# Altium schematic sheet 12_ADAU7118_CODEC.SchDoc: ADAU7118 PDM to TDM Codec
size B; DocumentNumber: 8; SheetNumber: 8; SheetTotal: 12
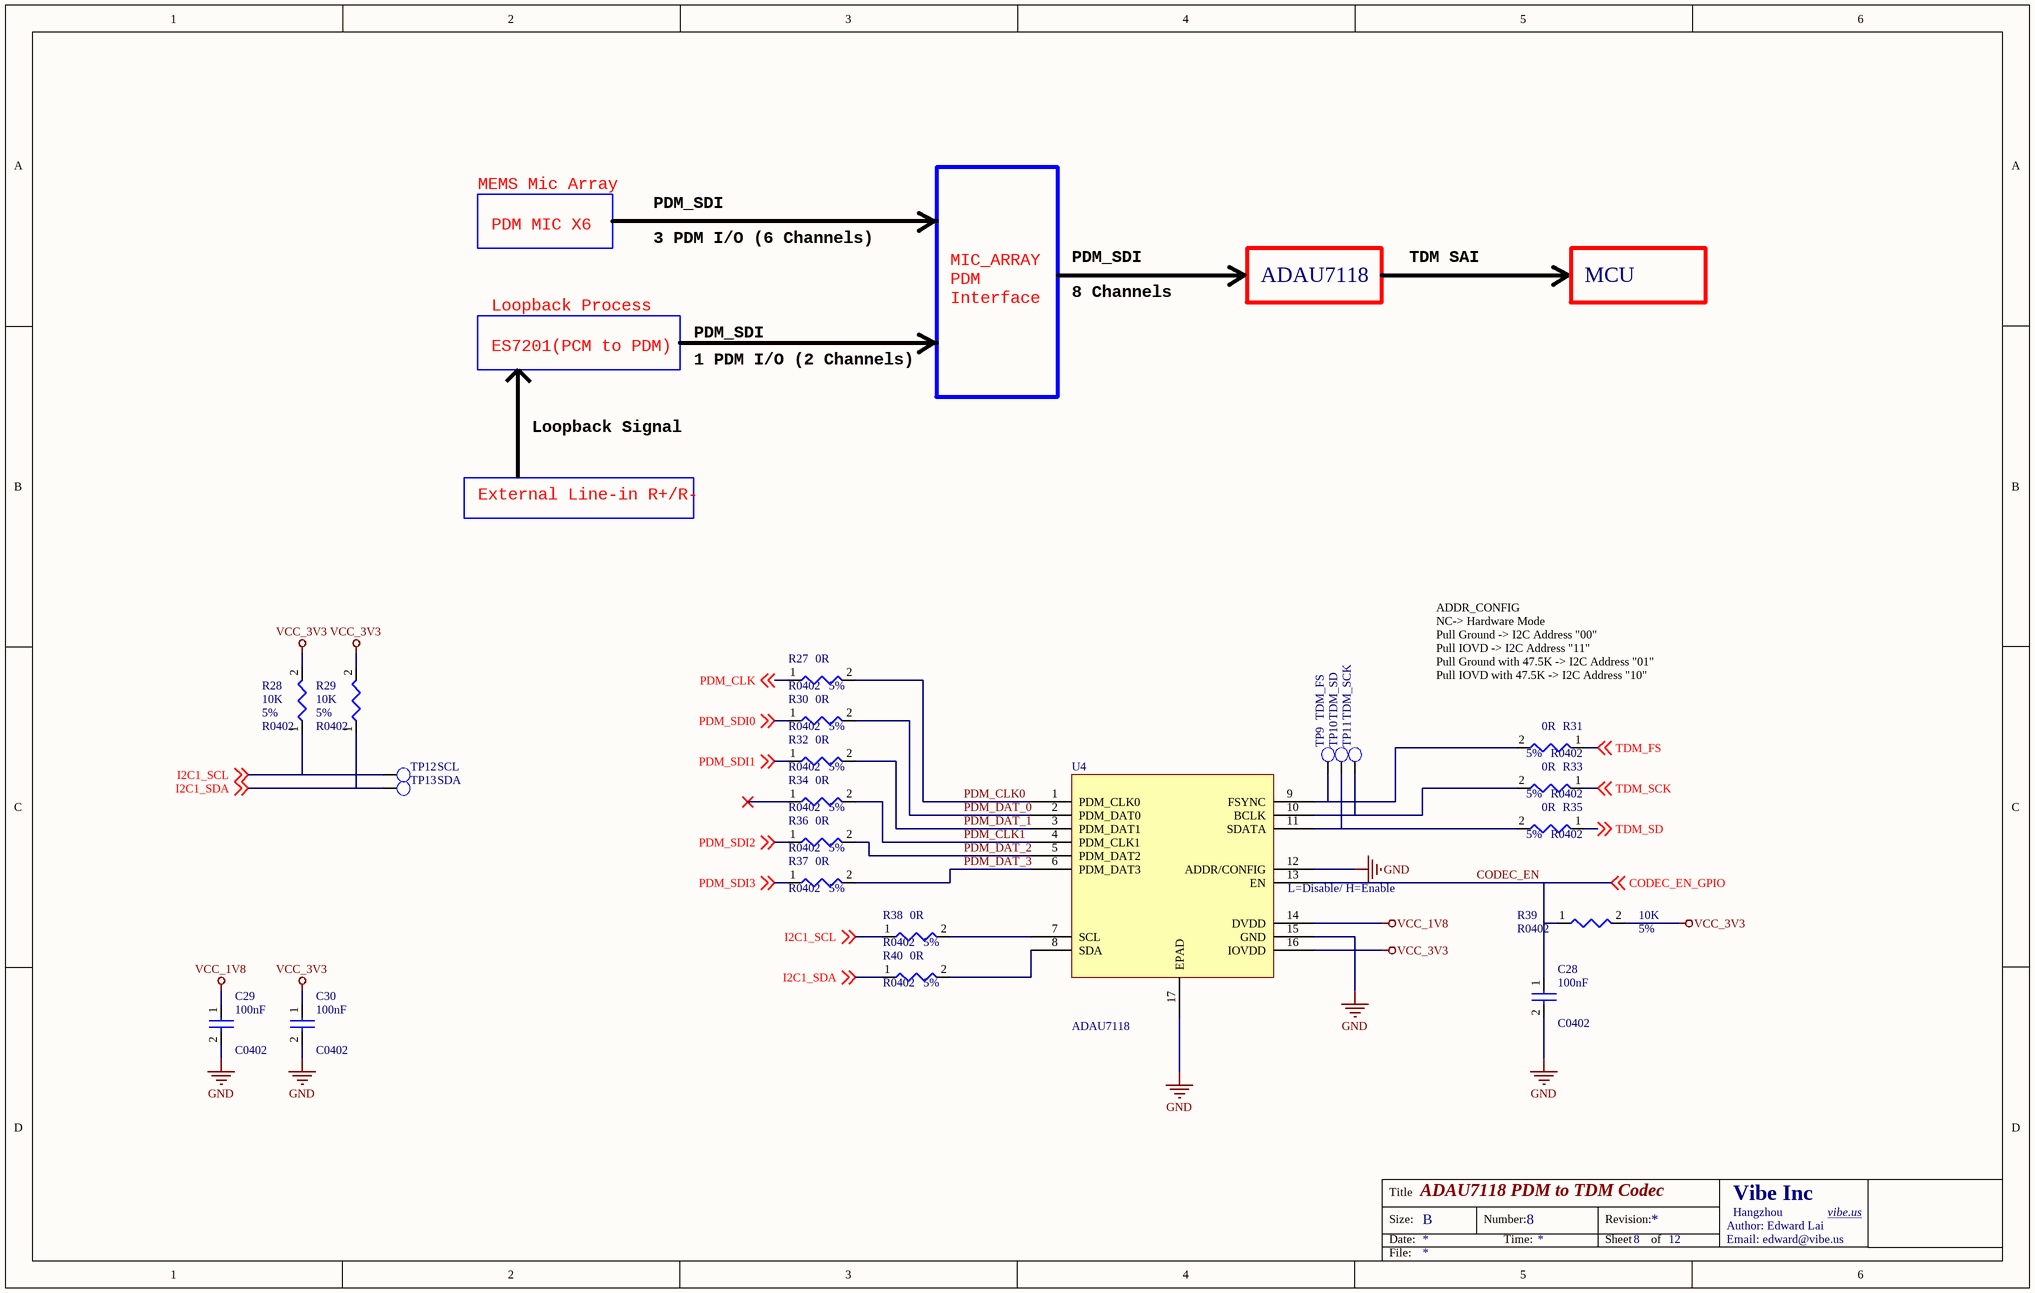
[diagram p0: 12_ADAU7118_CODEC.SchDoc]

## Parts
C28  100nF  PCB Footprint: C0402  [C0402_L]
C29  100nF  PCB Footprint: C0402  [C0402_L]
C30  100nF  PCB Footprint: C0402  [C0402_L]
R27  0R  Tolerance: 5%  [R0402]
R28  10K  Tolerance: 5%  [R0402]
R29  10K  Tolerance: 5%  [R0402]
R30  0R  Tolerance: 5%  [R0402]
R31  0R  Tolerance: 5%  [R0402]
R32  0R  Tolerance: 5%  [R0402]
R33  0R  Tolerance: 5%  [R0402]
R34  0R  Tolerance: 5%  [R0402]
R35  0R  Tolerance: 5%  [R0402]
R36  0R  Tolerance: 5%  [R0402]
R37  0R  Tolerance: 5%  [R0402]
R38  0R  Tolerance: 5%  [R0402]
R39  10K  Tolerance: 5%  [R0402]
R40  0R  Tolerance: 5%  [R0402]
TP9  TDM_FS  [TP_0R70]  (no BOM)
TP10  TDM_SD  [TP_0R70]  (no BOM)
TP11  TDM_SCK  [TP_0R70]  (no BOM)
TP12  SCL  [TP_0R70]  (no BOM)
TP13  SDA  [TP_0R70]  (no BOM)
U4  ADAU7118  [QFN50P300X300X80-17N]

## Nets
GND: C28.2 C29.2 C30.2 U4.12(ADDR/CONFIG) U4.15(GND) U4.17(EPAD)
VCC_1V8: C29.1 U4.14(DVDD)
VCC_3V3: C30.1 R28.2 R29.2 R39.2 U4.16(IOVDD)
CODEC_EN: C28.1 R39.1 U4.13(EN) ; off-sheet CODEC_EN_GPIO  [also labelled CODEC_EN_GPIO]
I2C1_SCL: R28.1 R38.1 TP12.1 ; off-sheet I2C1_SCL
I2C1_SDA: R29.1 R40.1 TP13.1 ; off-sheet I2C1_SDA
PDM_CLK: R27.1 ; off-sheet PDM_CLK
PDM_CLK0: R27.2 U4.1(PDM_CLK0)
PDM_CLK1: R34.2 U4.4(PDM_CLK1)
PDM_DAT_0: R30.2 U4.2(PDM_DAT0)
PDM_DAT_1: R32.2 U4.3(PDM_DAT1)
PDM_DAT_2: R36.2 U4.5(PDM_DAT2)
PDM_DAT_3: R37.2 U4.6(PDM_DAT3)
PDM_SDI0: R30.1 ; off-sheet PDM_SDI0
PDM_SDI1: R32.1 ; off-sheet PDM_SDI1
PDM_SDI2: R36.1 ; off-sheet PDM_SDI2
PDM_SDI3: R37.1 ; off-sheet PDM_SDI3
TDM_FS: R31.1 ; off-sheet TDM_FS
TDM_SCK: R33.1 ; off-sheet TDM_SCK
TDM_SD: R35.1 ; off-sheet TDM_SD
NetR31_2: R31.2 TP9.1 U4.9(FSYNC)
NetR33_2: R33.2 TP11.1 U4.10(BCLK)
NetR35_2: R35.2 TP10.1 U4.11(SDATA)
NetR38_2: R38.2 U4.7(SCL)
NetR40_2: R40.2 U4.8(SDA)

Not connected (* = marked no-connect by the designer): R34 1*

## Notes on the sheet
- MEMS Mic Array
- PDM MIC X6
- PDM_SDI
- 3 PDM I/O (6 Channels)
- 8 Channels
- ADAU7118
- TDM SAI
- MCU
- ES7201(PCM to PDM)
- Loopback Process
- 1 PDM I/O (2 Channels)
- MIC_ARRAY PDM Interface
- Loopback Signal
- External Line-in R+/R-
- ADDR_CONFIG
  NC-> Hardware Mode
  Pull Ground -> I2C Address "00"
  Pull IOVD -> I2C Address "11"
  Pull Ground with 47.5K -> I2C Address "01"
  Pull IOVD with 47.5K -> I2C Address "10"
- (near U4) L=Disable/ H=Enable
- Title
- Size:
- Date:
- B
- Number:
- Time:
- Revision:
- Sheet
- of
- Author: Edward Lai
- Email: edward@vibe.us
- Vibe Inc
- Hangzhou
- vibe.us <http://vibe.us>
- File:

## Library data of the parts
C28-C30 = CAP NP_Dup1: cap,1.0uF,+/-10%,6.3V,C0402; Priority: A; Part Type: C0402
R27 R30-R38 R40 = RESISTOR: 通用厚膜电阻,0R,+/-5%,R0402; Priority: A; PCB Footprint: R0402; Part Type: 通用厚膜电阻
R28 R29 R39 = RESISTOR: 通用厚膜电阻,10K,+/-5%,R0402; Priority: A; PCB Footprint: R0402; Part Type: 通用厚膜电阻
TP9-TP13 = TP: Test Point 0.7mm; PCB Footprint: TP_0R50; Priority: A; Part Type: TP
U4 = ADAU7118: 16-lead, 3 mm × 3 mm, 0.50 mm pitch LFCSP